# Altium schematic sheet MotherBoard_JetsonSupport.SchDoc
size A; SheetNumber: 9; SheetTotal: 9
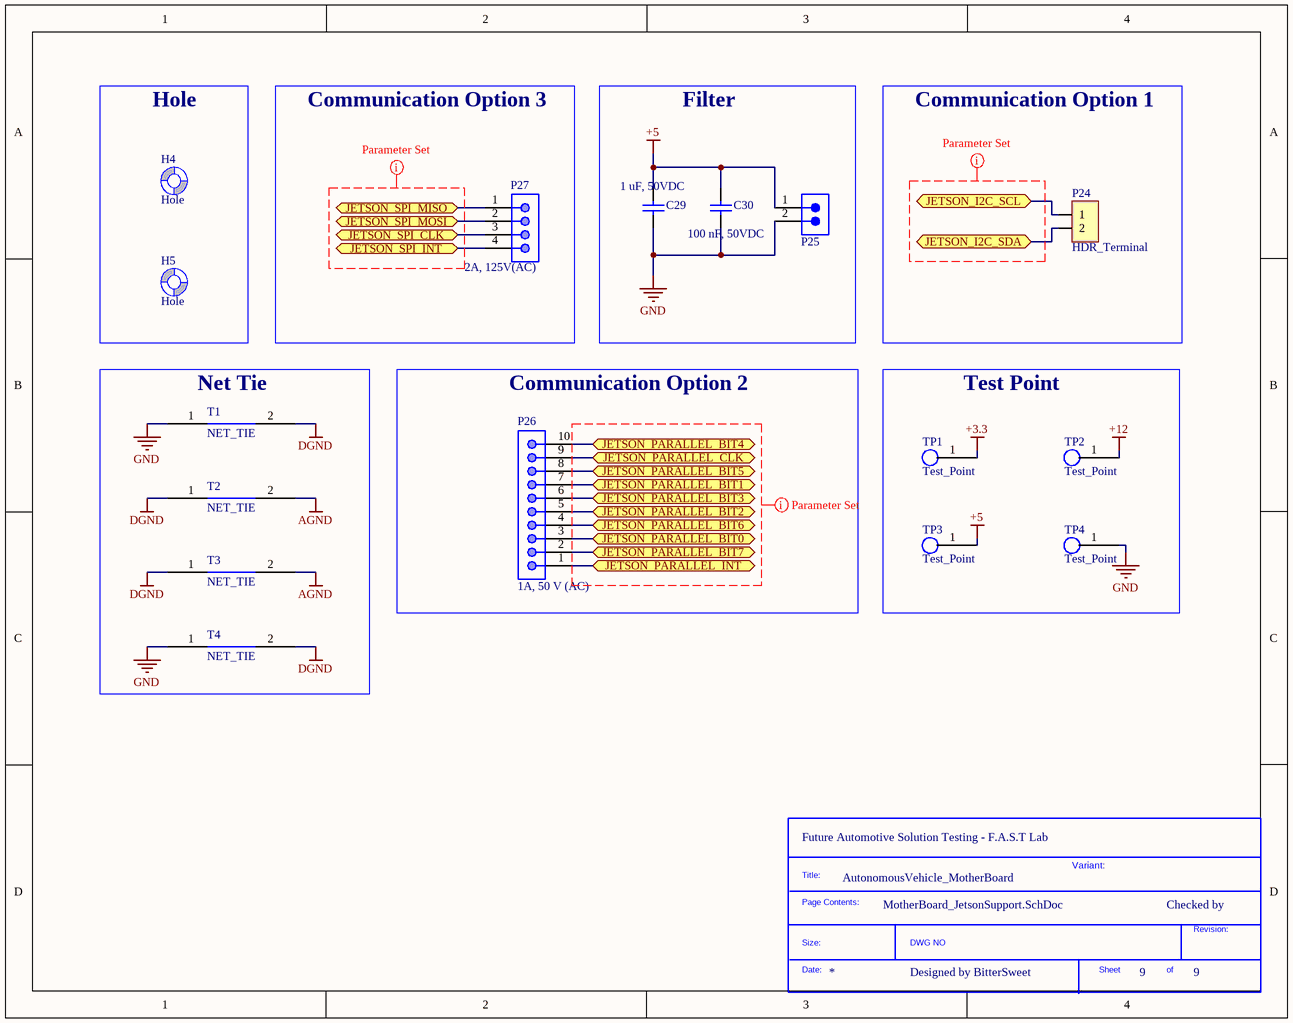
[diagram p0: MotherBoard_JetsonSupport.SchDoc]

## Parts
*?  SDTitleBlock  (value not drawn)  (graphical)
C29  1 uF, 50VDC  [CAP_RADIAL_2.54]
C30  100 nF, 50VDC  [CAP_RADIAL_2.54]
H4  Hole  [Hole_3.2mm]
H5  Hole  [Hole_3.2mm]
P24  HDR_Terminal  [HDR_HEADER_2.0_HORIZONTAL]
P25  10A, 300V  [691321300002]  (value not drawn)
P26  1A, 50 V (AC)  [648110131822]
P27  2A, 125V(AC)  [620104131822]
T1  NET_TIE  [NET_TIE_2.0mm]
T2  NET_TIE  [NET_TIE_0.5MM]
T3  NET_TIE  [NET_TIE_0.5MM]
T4  NET_TIE  [NET_TIE_2.0mm]
TP1  Test_Point  [TP_1_5mm_SMD]
TP2  Test_Point  [TP_1_5mm_SMD]
TP3  Test_Point  [TP_1_5mm_SMD]
TP4  Test_Point  [TP_1_5mm_SMD]

## Blocks framed on the sheet
Hole: H4 H5
Communication Option 3: P27
Filter: C29 C30 P25
Communication Option 1: P24
Net Tie: T1-T4
Communication Option 2: P26
Test Point: TP1-TP4

## Ports
JETSON_I2C_SCL (bidir), JETSON_I2C_SDA (bidir), JETSON_PARALLEL_BIT0 (bidir), JETSON_PARALLEL_BIT1 (bidir), JETSON_PARALLEL_BIT2 (bidir), JETSON_PARALLEL_BIT3 (bidir), JETSON_PARALLEL_BIT4 (bidir), JETSON_PARALLEL_BIT5 (bidir), JETSON_PARALLEL_BIT6 (bidir), JETSON_PARALLEL_BIT7 (bidir), JETSON_PARALLEL_CLK (bidir), JETSON_PARALLEL_INT (bidir), JETSON_SPI_CLK (bidir), JETSON_SPI_INT (bidir), JETSON_SPI_MISO (bidir), JETSON_SPI_MOSI (bidir)

## Nets
+3.3: TP1.1
+5: C29.1 C30.1 P25.1 TP3.1
+12: TP2.1
AGND: T2.2 T3.2
DGND: T1.2 T2.1 T3.1 T4.2
GND: C29.2 C30.2 P25.2 T1.1 T4.1 TP4.1
JETSON_I2C_SCL: P24.1 ; port JETSON_I2C_SCL
JETSON_I2C_SDA: P24.2 ; port JETSON_I2C_SDA
JETSON_PARALLEL_BIT0: P26.3 ; port JETSON_PARALLEL_BIT0
JETSON_PARALLEL_BIT1: P26.7 ; port JETSON_PARALLEL_BIT1
JETSON_PARALLEL_BIT2: P26.5 ; port JETSON_PARALLEL_BIT2
JETSON_PARALLEL_BIT3: P26.6 ; port JETSON_PARALLEL_BIT3
JETSON_PARALLEL_BIT4: P26.10 ; port JETSON_PARALLEL_BIT4
JETSON_PARALLEL_BIT5: P26.8 ; port JETSON_PARALLEL_BIT5
JETSON_PARALLEL_BIT6: P26.4 ; port JETSON_PARALLEL_BIT6
JETSON_PARALLEL_BIT7: P26.2 ; port JETSON_PARALLEL_BIT7
JETSON_PARALLEL_CLK: P26.9 ; port JETSON_PARALLEL_CLK
JETSON_PARALLEL_INT: P26.1 ; port JETSON_PARALLEL_INT
JETSON_SPI_CLK: P27.3 ; port JETSON_SPI_CLK
JETSON_SPI_INT: P27.4 ; port JETSON_SPI_INT
JETSON_SPI_MISO: P27.1 ; port JETSON_SPI_MISO
JETSON_SPI_MOSI: P27.2 ; port JETSON_SPI_MOSI

Not connected (* = marked no-connect by the designer): H4 1(Screw); H5 1(Screw)

## Layout directives
net class ParallelCommunication: (no net found under the mark)
net class JETSON_I2C: (no net found under the mark)
net class JETSON_SPI: (no net found under the mark)

## Notes on the sheet
- (near *?) Future Automotive Solution Testing - F.A.S.T Lab
- AutonomousVehicle_MotherBoard
- Variant:
- Checked by
- Designed by BitterSweet
- (in symbol SDTitleBlock) Title:; Page Contents:; Revision:; Size:; DWG NO; Date:; Sheet; of

## Library data of the parts
C29 C30 = Capacitor: ComponentLink1Description: ThegioiIC Link
  C29: ComponentLink1URL: https://www.thegioiic.com/tu-gom-multilayer-1uf-50v
  C30: ComponentLink1URL: https://www.thegioiic.com/tu-gom-tron-100nf-0-1uf-50v
P24 = HDR_Terminal: HDR_Terminal 2 pin; Supplier: ThegioiIC; ComponentLink1Description: URL; ComponentLink1URL: https://www.thegioiic.com/kf128-2-v-domino-2-chan-thang-3-5mm-300v-10a-han-pcb
P25 = 691321300002: WR-TBL Series 321 Vertical PCB Header, THT, pitch 3.81mm, 2p; Manufacturer: Wurth Elektronik; Modularity: No; ComponentLink1Description: Datasheet Link; ComponentLink1URL: https://www.we-online.com/redexpert/spec/691321300002?ad; ComponentLink2Description: Supplier 1 URL; ComponentLink2URL: N/A; Manufacturer Part Number: 691321300002; Category: Terminal Blocks; Match Code: WR-TBL; Mount: Through Hole; Operating Temperature Max: 105°C; Operating Temperature Min: -40°C; Packaging: Box; Application: Pluggable; Number of Pins: 2; Number of Rows: 1; Orientation: Vertical; Pitch: 3.81mm; Rated Current: 10A; Working Voltage: 300V; ComponentLink3Description: Supplier 2 URL; ComponentLink3URL: N/A; ComponentLink4Description: Supplier 3 URL; ComponentLink4URL: https://www.thegioiic.com/ul-3-81-2-v-terminal-block-plug-in-han-pcb-2-chan-thang-3-81mm-300v-10a-ulo; Supplier 1 Name: Mouser; Supplier 1 SN: N/A; Supplier 1 URL: N/A; Supplier 2 Name: Digi-Key; Supplier 2 SN: N/A; Supplier 2 URL: N/A; Supplier 3 Name: thegioiic; Supplier 3 SN: N/A; Supplier 3 URL: https://www.thegioiic.com/ul-3-81-2-v-terminal-block-plug-in-han-pcb-2-chan-thang-3-81mm-300v-10a-ulo; Value: 10A, 300V
P26 = 648110131822: WR-WTB SMT Male Horizontal Shrouded Header, pitch 1.5mm, 10p; Pin Number: 10; Contact Resistance: 20mOhm; Withstanding Voltage: 500VAC; Working Voltage: 50VAC; ComponentLink1Description: Manufacturer; ComponentLink1URL: http://www.we-online.de; ComponentLink2Description: Datasheet; ComponentLink2URL: https://www.we-online.com/catalog/datasheet/648110131822.pdf; Pitch: 1.5mm; Published Date: January 2020; Publisher: Wurth Elektronik; Mounting Technology: SMT; Packaging: Tape and Reel; Operating Temperature: -25 to +85degC; Part Number: 648110131822; Gender: Male; Type: Horizontal; Rated Current: 1A; ComponentLink3Description: Global Supply; ComponentLink3URL: https://www.we-online.com/en/components/products/WTB_1_50_SMT_MALE_HORIZONTAL_SHROUDED_HEADER_6481XX131822?sq=648110131822#648110131822; ComponentLink4Description: Global Supply; ComponentLink4URL: https://www.mouser.vn/ProductDetail/Wurth-Elektronik/648110131822?qs=3RJ0PdSuLVmrqG7i4WUbBw%3D%3D; Supplier 1 Name: Mouser; Supplier 1 SN: N/A; Supplier 1 URL: N/A; Supplier 2 Name: Digi-Key; Supplier 2 SN: N/A; Supplier 2 URL: N/A; Supplier 3 Name: thegioiic; Supplier 3 SN: N/A; Supplier 3 URL: N/A; Value: 1A, 50 V (AC)
P27 = 620104131822: WR-WTB SMT Male Horizontal Shrouded Header, pitch 2mm, 4p; Pin Number: 4; Contact Resistance: 20mOhm; Withstanding Voltage: 800VAC; Working Voltage: 100VAC; ComponentLink1Description: Manufacturer; ComponentLink1URL: http://www.we-online.de; ComponentLink2Description: Datasheet; ComponentLink2URL: https://www.we-online.com/catalog/datasheet/620104131822.pdf; Pitch: 2mm; Published Date: January 2020; Publisher: Wurth Elektronik; Mounting Technology: SMT; Packaging: Tape and Reel; Operating Temperature: -25 to +85degC; Part Number: 620104131822; Gender: Male; Type: Horizontal; Rated Current: 2A; ComponentLink3Description: Global Supply; ComponentLink3URL: https://www.we-online.com/en/components/products/WTB_2_00_SMT_MALE_HORIZONTAL_SHROUDED_HEADER_6201XX131822?sq=620104131822#620104131822; ComponentLink4Description: Global Supply; ComponentLink4URL: https://www.mouser.vn/ProductDetail/Wurth-Elektronik/620104131822?qs=ZtY9WdtwX57A7D%2FbILyVEQ%3D%3D; Supplier 1 Name: Mouser; Supplier 1 SN: 710-620104131822; Supplier 1 URL: https://www.mouser.vn/ProductDetail/Wurth-Elektronik/620104131822?qs=ZtY9WdtwX57A7D%2FbILyVEQ%3D%3D; Supplier 2 Name: Digi-Key; Supplier 2 SN: N/A; Supplier 2 URL: N/A; Supplier 3 Name: thegioiic; Supplier 3 SN: N/A; Supplier 3 URL: https://www.thegioiic.com/dau-ph2-0mm-4-chan-dan-smd-nam-ngang; Value: 2A, 125V(AC)
T1-T4 = NET_TIE: Straight Net Tie